# EasyEDA Pro project Echo EasyEDA professional project.epro, board PCB1
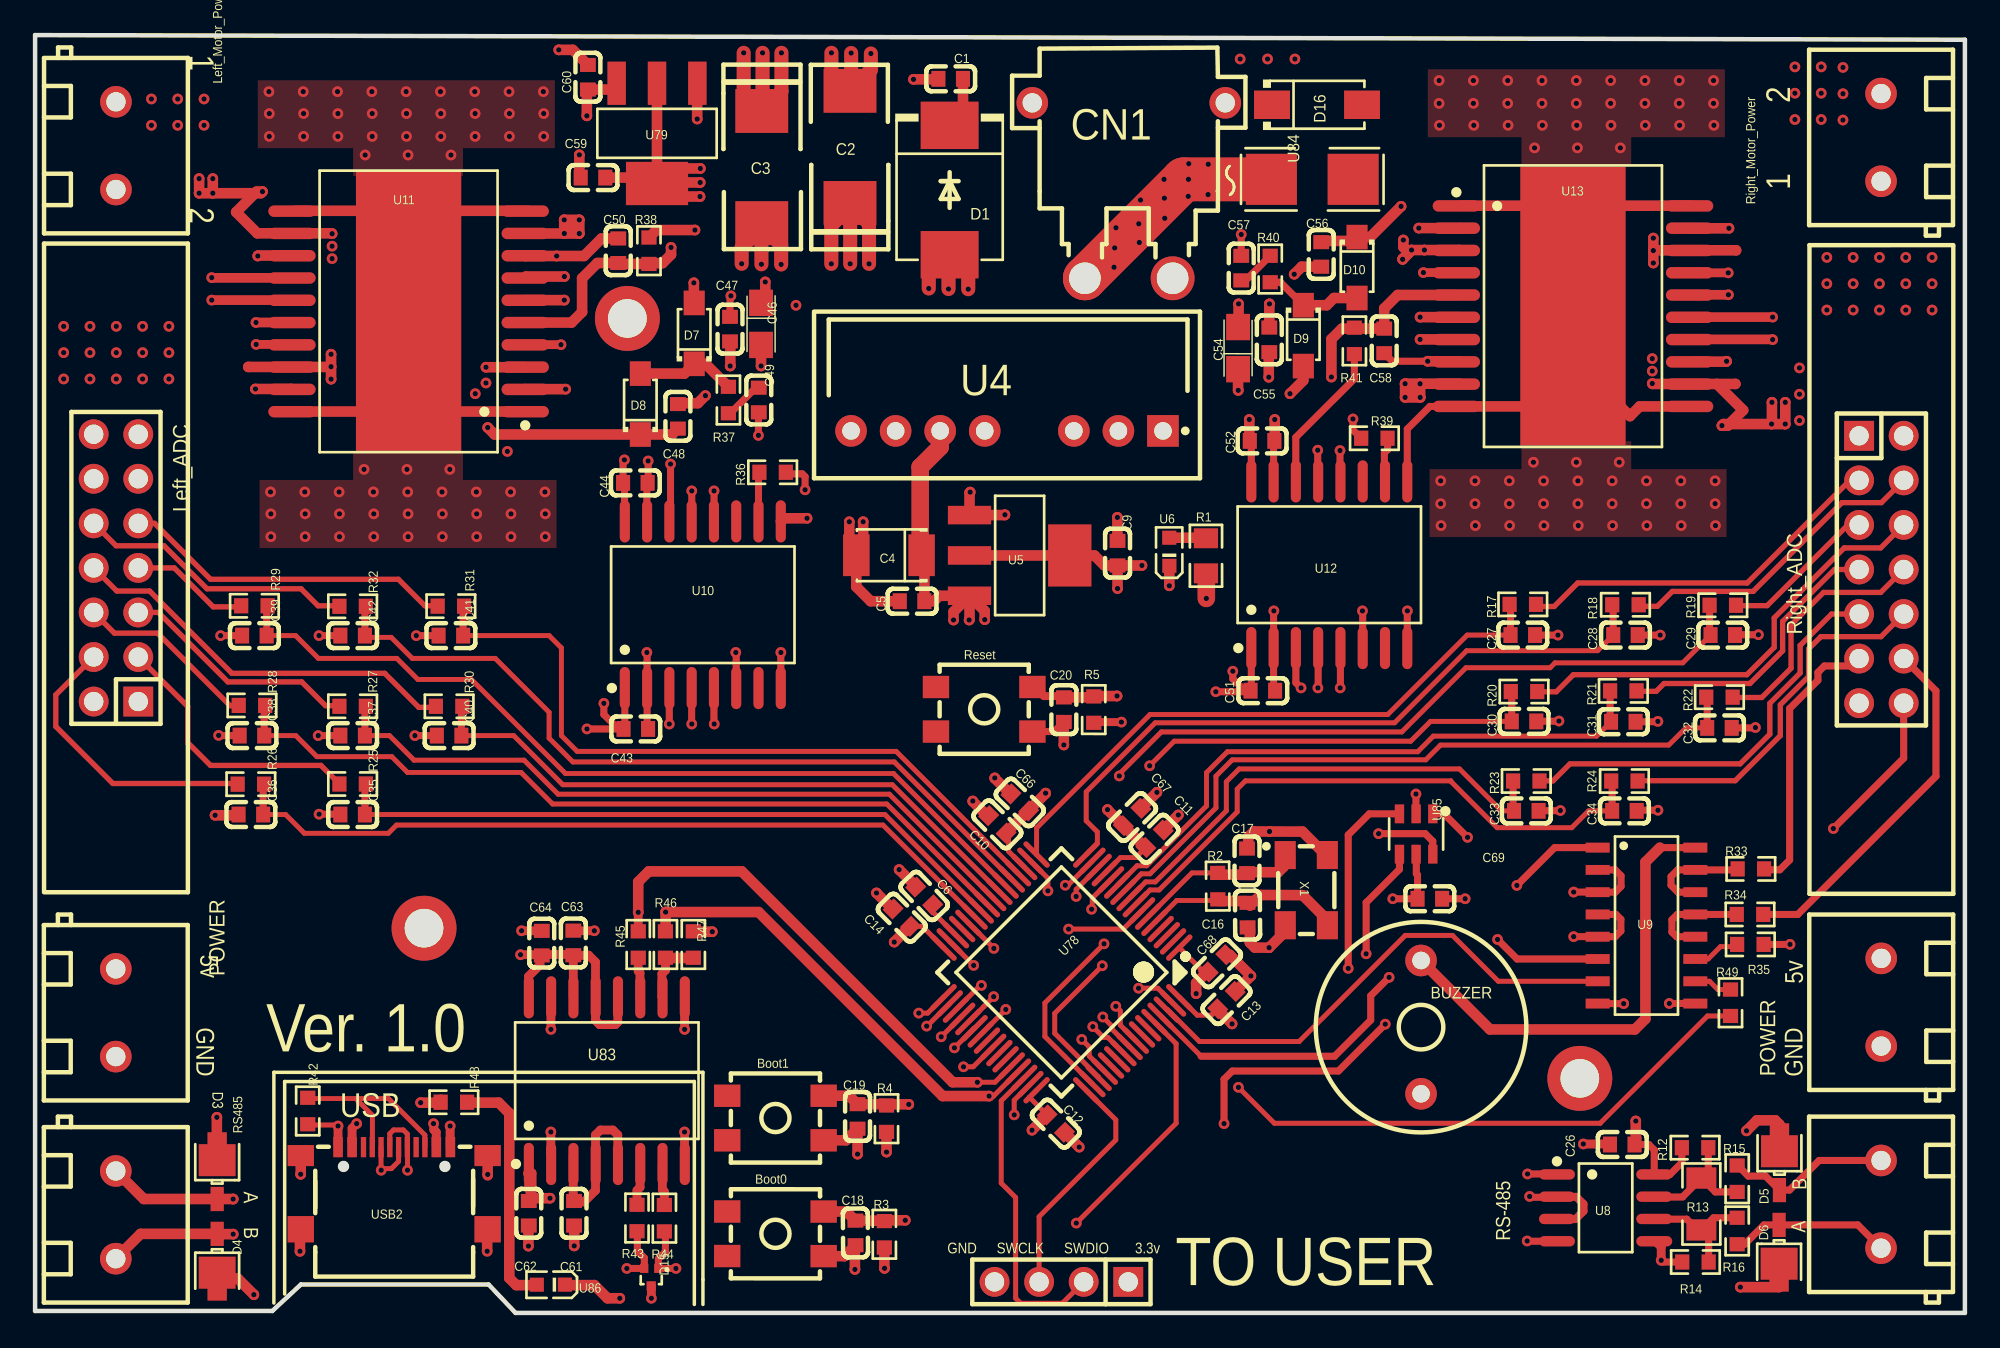
[diagram p1: board, top side]
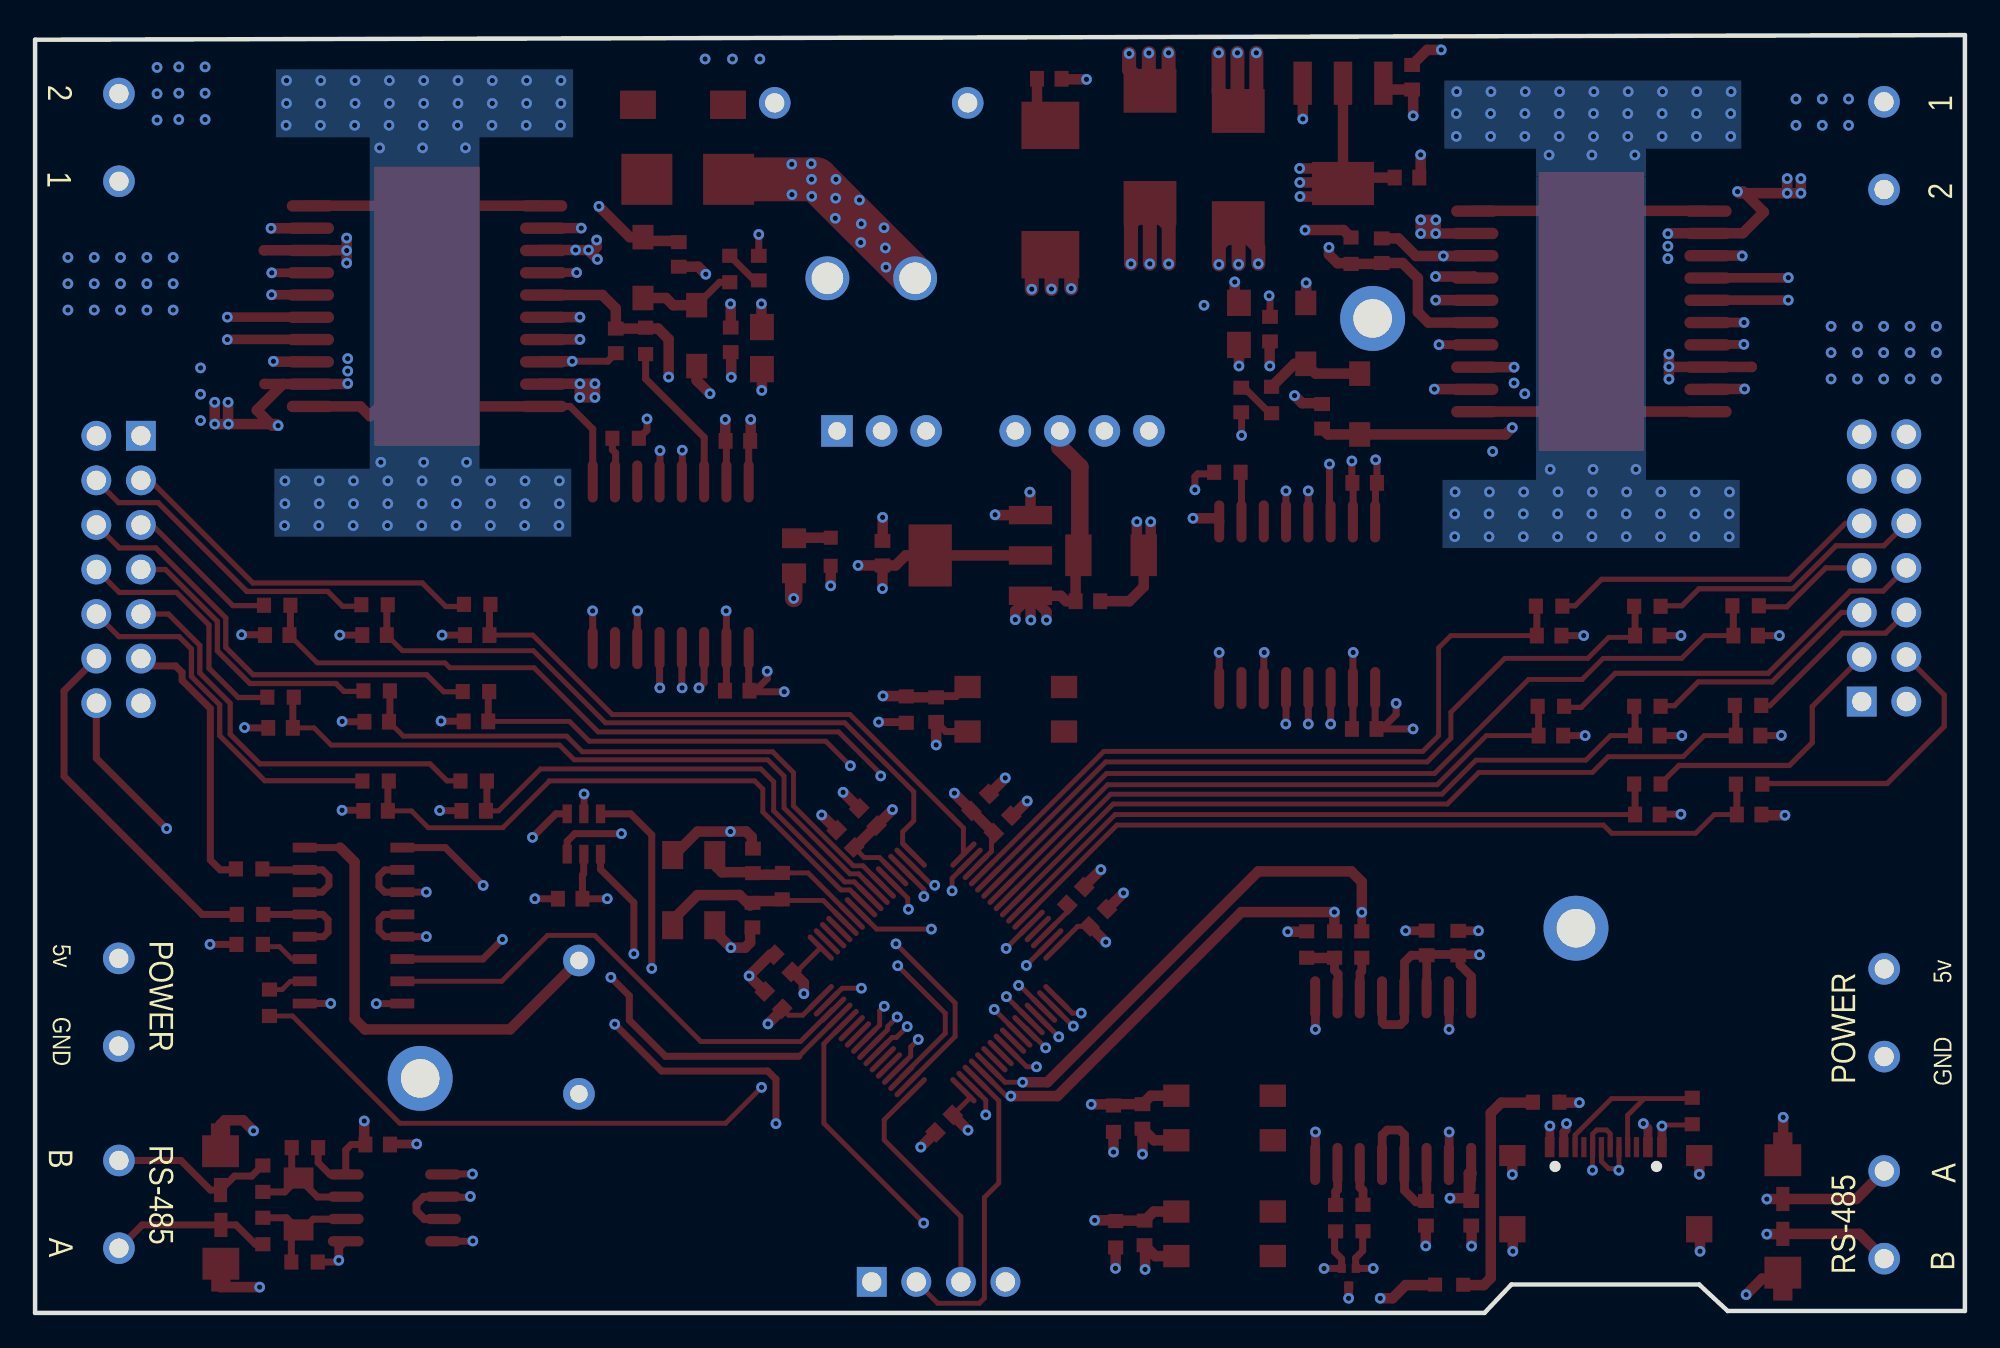
[diagram p2: board, bottom side, seen from below]

Outline 110 x 72.84 mm; copper layers: Top Layer, Inner1, Inner2, Bottom Layer. Coordinates in mm from the lower left corner of the outline.
Outline path: 0,72.84 0,0.11 13.52,0.11 15.15,1.62 25.85,1.62 27.39,0 110,0 110,72.58 0,72.84
Stack: Top Layer 0.035mm / Dielectric1 0.025mm FR4 er 4.5 / Dielectric4 0.48mm PP er 4.5 / Dielectric5 0.48mm PP er 4.5 / Inner1 0.035mm / Dielectric6 0.48mm PP er 4.5 / Inner2 0.035mm / Dielectric7 0.48mm PP er 4.5 / Bottom Layer 0.035mm

## Design rules (mm)
template: Custom Config
spacing copperThickness1oz (default): track to track 0.18, other pairs 0.18 to 0.3
spacing copperThickness2oz: track to track 0.203, other pairs 0.152 to 0.3
track width copperThickness1oz (default): min 0.127, default 0.254, max 2.54
track width copperThickness2oz: min 0.203, default 0.254, max 2.54
differential pair differentialPair (default): width min 0.127, default 0.254, max 2.54; gap min 0.152, default 0.152
via viaSize (default): diameter min 0.5, default 0.61, max 10; hole min 0.3, default 0.305, max 6.3

## Placement (name value [footprint] x y rotation side)
Boot0  7914G-1-000E  [KEY-SMD_4P-L5.0-W5.0-P2.54-LS5.5-BL]  42.2 4.51 180 top
Boot1  7914G-1-000E  [KEY-SMD_4P-L5.0-W5.0-P2.54-LS5.5-BL]  42.2 11.11 180 top
BUZZER  GMD12095YB-1.5V2400  [BUZ-TH_BD12.0-P7.60-D0.6-FD]  79 16.29 90 top
C1  0.1 uF 16v  [c0603]  52.19 70.35 180 top
C2  220 uF 16v  [CASE-E_7343]  46.45 66.47 270 top
C3  220 uF 16v  [CASE-E_7343]  41.42 65.32 90 top
C4  22 uF 10v  [CASE-B_3528]  48.67 43.19 180 top
C5  0.1 uF 10v  [C0603]  49.99 40.57 180 top
C6  4.7 uF 10v  [C0603]  50.68 23.77 313.6 top
C9  10 uF 10v  [C0603]  61.7 43.31 90 top
C10  0.1 uF 10v  [C0603]  54.85 27.85 315.1 top
C11  0.1 uF 10v  [C0603]  63.81 27.03 225 top
C12  0.1 uF 10v  [C0603]  58.18 10.79 135 top
C13  0.1 uF 10v  [C0603]  67.91 17.83 224.8 top
C14  0.1 uF 10v  [C0603]  49.4 22.53 315 top
C16  20 pF 10v  [C0603]  69.11 22.68 270.4 top
C17  20 pF 10v  [C0603]  69.08 25.77 89.9 top
C18  0.1 uF 10v  [C0603]  46.76 4.56 270.4 top
C19  0.1 uF 10v  [C0603]  46.88 11.2 270 top
C20  0.1 uF 10v  [C0603]  58.64 34.39 270 top
C26  0.1 uF 10v  [C0603]  90.47 9.6 0 top
C27  0.1 uF 10v  [C0603]  84.8 38.64 0 top
C28  0.1 uF 10v  [C0603]  90.65 38.64 0 top
C29  0.1 uF 10v  [C0603]  96.2 38.64 0 top
C30  0.1 uF 10v  [C0603]  84.87 33.72 0 top
C31  0.1 uF 10v  [C0603]  90.53 33.7 0 top
C32  0.1 uF 10v  [C0603]  96.01 33.35 180 top
C33  0.1 uF 10v  [C0603]  85 28.62 0 top
C34  0.1 uF 10v  [C0603]  90.59 28.62 0 top
C35  0.1 uF 10v  [C0603]  18.1 28.41 180 top
C36  0.1 uF 10v  [C0603]  12.3 28.41 180 top
C37  0.1 uF 10v  [C0603]  18.1 32.91 180 top
C38  0.1 uF 10v  [C0603]  12.36 32.91 180 top
C39  0.1 uF 10v  [C0603]  12.5 38.61 180 top
C40  0.1 uF 10v  [C0603]  23.6 32.91 0 top
C41  0.1 uF 10v  [C0603]  23.7 38.61 180 top
C42  0.1 uF 10v  [C0603]  18.1 38.61 0 top
C43  0.1 uF 10v  [C0603]  34.24 33.29 180 top
C44  0.1 uF 10v  [C0603]  34.21 47.32 180 top
C46  0,1 uF 16v  [CASE-A_3216]  41.38 56.38 270 top
C47  0,1 uF 16v  [C0603]  39.61 56.08 270 top
C48  CBoot_0,22uF 16v  [C0603]  36.64 51.11 90 top
C49  0,01 uF 16v  [C0603]  41.25 52.04 90 top
C50  5.6 nF 10v  [C0603]  33.24 60.55 90 top
C51  0.1 uF 10v  [C0603]  69.98 35.47 180 top
C52  0.1 uF 10v  [C0603]  69.94 49.71 180 top
C54  0,1 uF 16v  [CASE-A_3216]  68.57 55 90 top
C55  0,1 uF 16v  [C0603]  70.35 55.47 90 top
C56  CBoot_0,22uF 16v  [C0603]  73.31 60.34 270 top
C57  0,01 uF 16v  [C0603]  68.75 59.56 270 top
C58  5.6 nF 10v  [C0603]  76.9 55.41 270 top
C59  10 uF 16v  [C0603]  31.8 64.72 180 top
C60  0.1 uF 16v  [C0603]  31.51 70.44 90 top
C61  0.1uF 10v  [C0603]  30.72 5.68 270 top
C62  0.1uF 10v  [C0603]  28.14 5.68 270 top
C63  0.1uF 10v  [C0603]  30.68 21.09 90 top
C64  0.1uF 10v  [C0603]  28.88 21.08 270 top
C66  4.7 uF 10v  [C0603]  56.13 29.1 136.2 top
C67  1 uF 10v  [C0603]  62.53 28.27 224.8 top
C68  0.1 uF 10v  [C0603]  67.37 19.93 224.7 top
C69  0.1 uF 10v  [C0603]  79.5 23.61 180 top
CN1  XT30PW-M30.G.Y  [conn-th_xt30pw-m]  62.34 63.98 180 top
D1  SMCJ16A  [smc_l6.9-w5.9-ls7.9-rd]  52.13 64.01 270 top
D3  SM2T3V3A  [DO-216AA_L1.9-W1.9-LS3.8-FD]  10.38 7.77 270 top
D4  SM2T3V3A  [DO-216AA_L1.9-W1.9-LS3.8-FD]  10.38 3.23 90 top
D5  SM2T3V3A  [DO-216AA_L1.9-W1.9-LS3.8-FD]  99.43 8.28 270 top
D6  SM2T3V3A  [DO-216AA_L1.9-W1.9-LS3.8-FD]  99.41 3.74 90 top
D7  1N4148W  [SOD-123FL_L2.7-W1.6-LS3.8-RD]  37.57 55.84 90 top
D8  1N4148W  [SOD-123FL_L2.7-W1.6-LS3.8-RD]  34.5 51.81 90 top
D9  1N4148W  [SOD-123FL_L2.7-W1.6-LS3.8-RD]  72.29 55.71 270 top
D10  1N4148W  [SOD-123FL_L2.7-W1.6-LS3.8-RD]  75.35 59.59 270 top
D15  TPD2EUSB30DRTR-TP  [SOT-723-3_L1.2-W0.8-LS1.20-BR]  35.12 2.04 90 top
D16  SS510  [sma_l4.4-w2.8-ls5.4-rd]  73.07 68.87 0 top
H1  -  [HDR-TH_4P-P2.54-V-M]  58.5 1.77 180 top
Left_ADC  B-3100S14P-A110  [IDC-TH_310S-14P]  4.61 42.47 90 top
Left_Motor_Power  282836-2  [conn-th_2p-p5.00_282836-2]  4.61 66.54 270 top
NOREF  -  [Pad_e10924]  33.76 56.69 180 top
NOREF#2  -  [Pad_e12976]  22.17 21.93 180 top
NOREF#3  -  [Pad_e12977]  88.05 13.37 180 top
POWER  -  [conn-th_2p-p5.00_282836-2]  105.23 17.71 90 top
POWER#2  -  [conn-th_2p-p5.00_282836-2]  4.6 17.11 270 top
R1  150R  [R0805]  66.74 43.16 90 top
R2  1M  [R0603]  67.41 24.33 90.4 top
R3  10K  [R0603]  48.41 4.48 90 top
R4  10K  [R0603]  48.53 11.07 90 top
R5  10K  [R0603]  60.34 34.39 89.9 top
R12  20K  [R0603]  94.62 9.42 0 top
R13  120R  [R1206]  94.98 6.21 270 top
R14  20K  [R0603]  94.64 2.9 0 top
R15  47R  [R0603]  97.02 7.65 90 top
R16  47R  [R0603]  97.02 4.67 270 top
R17  10R  [R0603]  84.8 40.39 0 top
R18  10R  [R0603]  90.65 40.37 180 top
R19  10R  [R0603]  96.2 40.34 0 top
R20  10R  [R0603]  84.87 35.42 180 top
R21  10R  [R0603]  90.53 35.46 0 top
R22  10R  [R0603]  96.01 35.1 180 top
R23  10R  [R0603]  85 30.32 0 top
R24  10R  [R0603]  90.59 30.32 180 top
R25  10R  [R0603]  18.1 30.15 180 top
R26  10R  [R0603]  12.3 30.14 0 top
R27  10R  [R0603]  18.1 34.58 180 top
R28  10R  [R0603]  12.36 34.63 0 top
R29  10R  [R0603]  12.5 40.31 180 top
R30  10R  [R0603]  23.6 34.58 0 top
R31  10R  [R0603]  23.7 40.29 180 top
R32  10R  [R0603]  18.1 40.28 0 top
R33  150R  [R0603]  97.8 25.31 0 top
R34  150R  [R0603]  97.75 22.72 0 top
R35  150R  [R0603]  97.77 21.01 0 top
R36  10K  [R0603]  42.04 47.92 180 top
R37  100R  [R0603]  39.52 52.04 270 top
R38  10K  [R0603]  34.99 60.55 270 top
R39  10K  [R0603]  76.34 49.86 0 top
R40  100R  [R0603]  70.4 59.51 90 top
R41  10K  [R0603]  75.2 55.41 90 top
R42  5,1K  [R0603]  15.54 11.51 270 top
R43  24R  [R0603]  34.31 5.41 90 top
R44  24R  [R0603]  35.87 5.4 90 top
R45  24R  [R0603]  34.38 21 90 top
R46  24R  [R0603]  35.93 21 90 top
R47  330R  [R0603]  37.52 21 270 top
R48  1K  [R0603]  23.87 12.01 0 top
R49  150R  [R0603]  96.64 17.68 270 top
Reset  7914G-1-000E  [KEY-SMD_4P-L5.0-W5.0-P2.54-LS5.5-BL]  54.1 34.41 180 top
Right_ADC  B-3100S14P-A110  [IDC-TH_310S-14P]  105.24 42.38 270 top
Right_Motor_Power  282836-2  [conn-th_2p-p5.00_282836-2]  105.22 67.01 90 top
RS485  282836-2  [CONN-TH_2P-P5.00_282836-2]  4.6 5.59 270 top
RS485_2  282836-2  [CONN-TH_2P-P5.00_282836-2]  105.22 6.19 90 top
U4  UWF1205S-3WR3  [pwrm-th_uwfxxxxs-3wr3]  55.4 50.28 180 top
U5  LD1117S33TR  [SOT-223_L6.5-W3.5-P2.30-LS7.0-BR]  56.12 43.18 180 top
U6  KP-1608MGC  [LED0603-RD_GREEN]  64.65 43.39 90 top
U8  MAX485ESA  [SOIC-8_L4.9-W3.9-P1.27-LS6.0-BL]  89.52 5.99 270 top
U9  TBD62003AFG,EL  [SOP-16_L10.0-W4.4-P1.27-LS6.3-BL]  91.85 22.08 270 top
U10  ISO7740DWR  [SOIC-16_L10.3-W7.5-P1.27-LS10.3-BL]  38.06 40.37 0 top
U11  L6205PD  [POWERSO20_L15.9-W11.0-P1.27-LS14.2-BL-EP]  21.29 57.09 90 top
U12  ISO7740DWR  [SOIC-16_L10.3-W7.5-P1.27-LS10.3-BL]  73.77 42.65 0 top
U13  L6205PD  [POWERSO20_L15.9-W11.0-P1.27-LS14.2-BL-EP]  87.66 57.39 270 top
U78  STM32F401RET6  [LQFP-64_L10.0-W10.0-P0.50-LS12.0-BL]  58.5 19.41 135 top
U79  LD1117S33TR  [SOT-223_L6.5-W3.5-P2.30-LS7.0-BR]  35.45 67.24 90 top
U83  ADUM4160BRWZ-RL  [SOIC-16_L10.3-W7.5-P1.27-LS10.3-BL]  32.59 13.24 0 top
U84  045106.3MRL  [fuse-smd_l6.1-w2.6]  72.8 64.62 0 top
U85  MAX6817EUT+T  [SOT-23-6_L2.9-W1.6-P0.95-LS2.8-BL]  78.72 27.3 180 top
U86  KP-1608MGC  [LED0603-RD_GREEN]  29.4 1.61 180 top
USB2  USB-TYPE-C-020  [USB-SMD_USB-TYPE-C-020]  20.47 7.11 0 top
X1  16MHz  [CRYSTAL-SMD_4P-L5.0-W3.2-BL]  72.46 24.1 270 top

## Footprints (pads in the part's own frame, mm; a bottom-side part is the same pattern mirrored in y, then rotated)
BUZ-TH_BD12.0-P7.60-D0.6-FD
  round 1.8 hole 1: 1(-3.8,0) 2(3.8,0)
c0603
  rect 0.8x0.9 smd: 1(-0.7,0) 2(0.7,0)
C0603
  rect 0.8x0.9 smd: 1(-0.7,0) 2(0.7,0)
CASE-A_3216
  rect 1.5x1.359 smd: 1(-1.2,0) 2(1.2,0)
CASE-B_3528
  rect 1.506x2.376 smd: 1(-1.861,0) 2(1.861,0)
CASE-E_7343
  rect 2.5x3.01 smd: 1(3.196,0) 2(-3.196,0)
conn-th_2p-p5.00_282836-2
  round 1.8 hole 1.1: 1(-2.5,0) 2(2.5,0)
CONN-TH_2P-P5.00_282836-2
  round 1.8 hole 1.1: 1(-2.5,0) 2(2.5,0)
conn-th_xt30pw-m
  round 2.5 hole 1.8: 1(-2.5,5) 2(2.5,5)
  round 1.8 hole 1.1: 3(5.5,-5) 4(-5.5,-5)
CRYSTAL-SMD_4P-L5.0-W3.2-BL
  rect 1.6x1.2 smd: 1(-2,-1.2) 2(2,-1.2) 3(2,1.2) 4(-2,1.2)
DO-216AA_L1.9-W1.9-LS3.8-FD
  custom 2.5x2.1 smd: 1(-1.276,0)
  rect 1.38x0.75 smd: 2(1.276,0)
fuse-smd_l6.1-w2.6
  rect 2.91x2.91 smd: 1(-2.33,0) 2(2.33,0)
HDR-TH_4P-P2.54-V-M
  rect 1.7x1.7 hole 1.1: 1(-3.81,0)
  round 1.7 hole 1.1: 2(-1.27,0) 3(1.27,0) 4(3.81,0)
IDC-TH_310S-14P
  rect 1.7x1.7 hole 1.1: 1(-7.62,-1.27)
  round 1.7 hole 1.1: 2(-7.62,1.27) 3(-5.08,-1.27) 4(-5.08,1.27) 5(-2.54,-1.27) 6(-2.54,1.27) 7(0,-1.27) 8(0,1.27) 9(2.54,-1.27) 10(2.54,1.27) 11(5.08,-1.27) 12(5.08,1.27) 13(7.62,-1.27) 14(7.62,1.27)
KEY-SMD_4P-L5.0-W5.0-P2.54-LS5.5-BL
  rect 1.5x1.273 smd: 1(-2.75,-1.27) 2(2.75,-1.27) 3(2.75,1.27) 4(-2.75,1.27)
LED0603-RD_GREEN
  rect 0.8x0.8 smd: 1(-0.799,-0.004) 2(0.799,0.004)
LQFP-64_L10.0-W10.0-P0.50-LS12.0-BL
  oval 0.3x2 smd: 1(-3.75,-5.75) 2(-3.25,-5.75) 3(-2.75,-5.75) 4(-2.25,-5.75) 5(-1.75,-5.75) 6(-1.25,-5.75) 7(-0.75,-5.75) 8(-0.25,-5.75) 9(0.25,-5.75) 10(0.75,-5.75) 11(1.25,-5.75) 12(1.75,-5.75) 13(2.25,-5.75) 14(2.75,-5.75) 15(3.25,-5.75) 16(3.75,-5.75) 33(3.75,5.75) 34(3.25,5.75) 35(2.75,5.75) 36(2.25,5.75) 37(1.75,5.75) 38(1.25,5.75) 39(0.75,5.75) 40(0.25,5.75) 41(-0.25,5.75) 42(-0.75,5.75) 43(-1.25,5.75) 44(-1.75,5.75) 45(-2.25,5.75) 46(-2.75,5.75) 47(-3.25,5.75) 48(-3.75,5.75)
  oval 2x0.3 smd: 17(5.75,-3.75) 18(5.75,-3.25) 19(5.75,-2.75) 20(5.75,-2.25) 21(5.75,-1.75) 22(5.75,-1.25) 23(5.75,-0.75) 24(5.75,-0.25) 25(5.75,0.25) 26(5.75,0.75) 27(5.75,1.25) 28(5.75,1.75) 29(5.75,2.25) 30(5.75,2.75) 31(5.75,3.25) 32(5.75,3.75) 49(-5.75,3.75) 50(-5.75,3.25) 51(-5.75,2.75) 52(-5.75,2.25) 53(-5.75,1.75) 54(-5.75,1.25) 55(-5.75,0.75) 56(-5.75,0.25) 57(-5.75,-0.25) 58(-5.75,-0.75) 59(-5.75,-1.25) 60(-5.75,-1.75) 61(-5.75,-2.25) 62(-5.75,-2.75) 63(-5.75,-3.25) 64(-5.75,-3.75)
Pad_e10924
  round 3.7 hole 2.2: 65(0,0)
Pad_e12976
  round 3.7 hole 2.2: 65(0,0)
Pad_e12977
  round 3.7 hole 2.2: 65(0,0)
POWERSO20_L15.9-W11.0-P1.27-LS14.2-BL-EP
  oval 0.651x2.696 smd: 1(-5.715,-6.647) 2(-4.445,-6.647) 3(-3.175,-6.647) 4(-1.905,-6.647) 5(-0.635,-6.647) 6(0.635,-6.647) 7(1.905,-6.647) 8(3.175,-6.647) 9(4.445,-6.647) 10(5.715,-6.647) 11(5.715,6.647) 12(4.445,6.647) 13(3.175,6.647) 14(1.905,6.647) 15(0.635,6.647) 16(-0.635,6.647) 17(-1.905,6.647) 18(-3.175,6.647) 19(-4.445,6.647) 20(-5.715,6.647)
  rect 15.9x6 smd: 21(0,0)
pwrm-th_uwfxxxxs-3wr3
  rect 1.8x1.8 hole 1: 1(-8.89,0)
  round 1.8 hole 1: 2(-6.35,0) 3(-3.81,0) 5(1.27,0) 6(3.81,0) 7(6.35,0) 8(8.89,0)
R0603
  rect 0.806x0.864 smd: 1(-0.753,0) 2(0.753,0)
R0805
  rect 1.133x1.377 smd: 1(-1,0) 2(1,0)
R1206
  rect 1.208x1.701 smd: 1(-1.479,0) 2(1.479,0)
sma_l4.4-w2.8-ls5.4-rd
  rect 2.046x1.62 smd: 1(-2.566,0) 2(2.566,0)
smc_l6.9-w5.9-ls7.9-rd
  rect 2.7x3.3 smd: 1(-3.687,0) 2(3.687,0)
SOD-123FL_L2.7-W1.6-LS3.8-RD
  rect 1.4x1.2 smd: 1(-1.735,0) 2(1.735,0)
SOIC-8_L4.9-W3.9-P1.27-LS6.0-BL
  oval 0.588x2.045 smd: 1(-1.905,-2.772) 2(-0.635,-2.772) 3(0.635,-2.772) 4(1.905,-2.772) 5(1.905,2.772) 6(0.635,2.772) 7(-0.635,2.772) 8(-1.905,2.772)
SOIC-16_L10.3-W7.5-P1.27-LS10.3-BL
  oval 0.574x2.401 smd: 1(-4.445,-4.75) 2(-3.175,-4.75) 3(-1.905,-4.75) 4(-0.635,-4.75) 5(0.635,-4.75) 6(1.905,-4.75) 7(3.175,-4.75) 8(4.445,-4.75) 9(4.445,4.75) 10(3.175,4.75) 11(1.905,4.75) 12(0.635,4.75) 13(-0.635,4.75) 14(-1.905,4.75) 15(-3.175,4.75) 16(-4.445,4.75)
SOP-16_L10.0-W4.4-P1.27-LS6.3-BL
  rect 0.56x1.365 smd: 1(-4.445,-2.783) 2(-3.175,-2.783) 3(-1.905,-2.783) 4(-0.635,-2.783) 5(0.635,-2.783) 6(1.905,-2.783) 7(3.175,-2.783) 8(4.445,-2.783) 9(4.445,2.783) 10(3.175,2.783) 11(1.905,2.783) 12(0.635,2.783) 13(-0.635,2.783) 14(-1.905,2.783) 15(-3.175,2.783) 16(-4.445,2.783)
SOT-23-6_L2.9-W1.6-P0.95-LS2.8-BL
  rect 0.532x1.072 smd: 1(-0.95,-1.149) 2(0,-1.149) 3(0.95,-1.149) 4(0.95,1.149) 5(0,1.149) 6(-0.95,1.149)
SOT-223_L6.5-W3.5-P2.30-LS7.0-BR
  rect 2.465x1.05 smd: 1(2.857,-2.3) 2(2.857,0) 3(2.857,2.3)
  rect 2.465x3.54 smd: 4(-2.857,0)
SOT-723-3_L1.2-W0.8-LS1.20-BR
  rect 0.52x0.47 smd: 1(0.5,-0.4) 2(0.5,0.4)
  rect 0.52x0.52 smd: 3(-0.5,0)
USB-SMD_USB-TYPE-C-020
  rect 1.5x1.2 smd: 17(-5.325,1.86) 18(5.325,1.86)
  rect 1.5x1.5 smd: 19(-5.325,-2.34) 20(5.325,-2.34)
  rect 0.3x1.15 smd: A1(-3.325,2.34) A4(-2.525,2.34) A5(-1.25,2.34) A6(-0.25,2.34) A7(0.25,2.34) A8(1.25,2.34) A9(2.525,2.34) A12(3.325,2.34) B1(3.075,2.34) B4(2.275,2.34) B5(1.75,2.34) B6(0.75,2.34) B7(-0.75,2.34) B8(-1.75,2.34) B9(-2.275,2.34) B12(-3.075,2.34)

## Nets
3.3V: C44.2 C52.2 C59.1 R36.1 R39.1 U10.16 U12.16 U79.2 U79.4
5V: C4.1 C5.1 C26.2 POWER.2 POWER#2.1 R12.1 U4.6 U5.3 U8.8
5V_USB: C62.1 R48.1 U83.1 USB2.A4 USB2.A9 USB2.B4 USB2.B9
12V: C1.1 C2.1 C3.1 C46.1 C47.1 C48.2 C54.1 C55.1 C56.2 C60.1 CN1.3 CN1.4 D1.1 D7.2 D9.2 D16.1 U4.2 U11.2 U11.19 U13.2 U13.19 U79.3
AGND: C4.2 C5.2 C6.1 C9.2 C10.1 C11.1 C12.1 C13.1 C14.1 C16.2 C17.2 C20.2 C26.1 C27.2 C28.2 C29.2 C30.2 C31.2 C32.1 C33.2 C34.2 C35.2 C36.2 C37.2 C38.2 C39.2 C40.1 C41.2 C42.1 C43.1 C51.1 C63.2 C64.1 C66.2 C67.1 C68.1 C69.1 D3.1 D4.1 D5.1 D6.1 H1.4 Left_ADC.2 POWER.1 POWER#2.2 R3.1 R4.1 R14.1 Reset.4 Right_ADC.2 U4.7 U5.1 U6.1 U8.5 U9.8 U10.2 U10.6 U10.8 U12.2 U12.6 U12.8 U78.12 U78.18 U78.31 U78.47 U78.63 U83.9 U83.15 U85.2 X1.2 X1.4
GND: C1.2 C2.2 C3.2 C44.1 C46.2 C47.2 C50.2 C52.1 C54.2 C55.2 C58.2 C59.2 C60.2 CN1.1 D1.2 U4.1 U10.9 U10.15 U11.1 U11.8 U11.10 U11.11 U11.13 U11.20 U11.21 U12.9 U12.15 U13.1 U13.8 U13.10 U13.11 U13.13 U13.20 U13.21 U79.1
+3.3AV: Boot0.4 Boot1.4 BUZZER.1 C9.1 C10.2 C11.2 C12.2 C13.2 C14.2 C18.2 C19.2 C43.2 C51.2 C63.1 C64.2 C66.1 C67.2 C68.2 C69.2 H1.1 Left_ADC.1 R1.1 R5.1 R47.1 Right_ADC.1 U5.2 U5.4 U9.9 U10.1 U12.1 U78.1 U78.13 U78.19 U78.32 U78.48 U78.64 U83.12 U83.13 U83.14 U83.16 U85.5
ADC1_IN0: C30.1 R20.2 U78.14
ADC1_IN1: C29.1 R19.1 U78.15
ADC1_IN2: C28.1 R18.2 U78.16
ADC1_IN3: C27.1 R17.1 U78.17
ADC1_IN4: C41.1 R31.1 U78.20
ADC1_IN5: C42.2 R32.2 U78.21
ADC1_IN6: C39.1 R29.1 U78.22
ADC1_IN7: C40.2 R30.2 U78.23
ADC1_IN8: C35.1 R25.1 U78.26
ADC1_IN9: C36.1 R26.2 U78.27
ADC1_IN10: C34.1 R24.2 U78.8
ADC1_IN11: C33.1 R23.1 U78.9
ADC1_IN12: C32.2 R22.2 U78.10
ADC1_IN13: C31.1 R21.1 U78.11
ADC1_IN14: C37.1 R27.1 U78.24
ADC1_IN15: C38.1 R28.2 U78.25
BOOT0: Boot0.1 C18.1 R3.2 U78.60
BOOT1: Boot1.1 C19.1 R4.2 U78.28
BUZZER: U9.1 U78.41
DIRECTION_LEFT_MOTOR: U10.5 U78.57
DIRECTION_LEFT_MOTOR_ISO: U10.12 U11.7 U11.15
DIRECTION_RIGHT_MOTOR: U12.5 U78.52
DIRECTION_RIGHT_MOTOR_ISO: U12.12 U13.7 U13.15
ENABLE_1: C50.1 R38.2 U11.5 U11.16
ENABLE_2: C58.1 R41.2 U13.5 U13.16
ENABLE_LEFT_MOTOR: U10.3 U78.55
ENABLE_LEFT_MOTOR_ISO: R38.1 U10.14
ENABLE_RIGHT_MOTOR: U12.3 U78.51
ENABLE_RIGHT_MOTOR_ISO: R41.1 U12.14
NRST: C20.1 R5.2 Reset.1 U78.7
OUT1_1: Left_Motor_Power.1 U11.9 U11.12
OUT1_2: Right_Motor_Power.1 U13.9 U13.12
OUT2_1: Left_Motor_Power.2 U11.3 U11.18
OUT2_2: Right_Motor_Power.2 U13.3 U13.18
PH0/OSC/IN: C16.1 R2.1 U78.5 X1.3
PH1/OSC/OUT: C17.1 R2.2 U78.6 X1.1
RE_DE: U8.2 U8.3 U78.39
SENSE_LVL_1: U9.2 U9.3 U78.33
SENSE_LVL_1_OUT: R33.2 Right_ADC.11
SENSE_LVL_2: U9.4 U9.5 U78.34
SENSE_LVL_2_OUT: R34.2 Right_ADC.12
SENSE_LVL_3: U9.6 U78.35
SENSE_LVL_3_OUT: R35.2 Right_ADC.13
SENSE_SIGNAL: Right_ADC.14 U85.1
SENSE_SIGNAL_CLEAR: U78.36 U85.6
START_DATASET_COLLECTION: Left_ADC.14 U85.3
START_DATASET_COLLECTION_CLEAR: U78.61 U85.4
START_DATASET_COLLECTION_LED: U9.7 U78.62
START_DATASET_COLLECTION_OUT: Left_ADC.11 R49.2
SWCLK: H1.3 U78.49
SWDIO: H1.2 U78.46
TIM2_CH1_PWM_RIGHT: U12.4 U78.50
TIM2_CH1_PWM_RIGHT_ISO: U12.13 U13.6 U13.14
TIM3_CH1_PWM_LEFT: U10.4 U78.56
TIM3_CH1_PWM_LEFT_ISO: U10.13 U11.6 U11.14
UGND: C61.2 C62.2 D15.3 R42.2 U83.2 U83.8 U86.1 USB2.17 USB2.18 USB2.19 USB2.20 USB2.A1 USB2.A12 USB2.B1 USB2.B12
USART6_RX: U8.1 U78.38
USART6_TX: U8.4 U78.37
USB_DM: R45.2 U78.44
USB_DP: R46.2 U78.45
VBOOT_1: C48.1 D8.1 U11.17
VBOOT_2: C56.1 D10.1 U13.17
VCAP_1: C6.2 U78.30
VCP_1: C49.1 U11.4
VCP_2: C57.1 U13.4
$1N14481: R1.2 U6.2
$1N50612: R34.1 U9.12 U9.13
$1N52994: C49.2 R37.2
$1N52996: D7.1 D8.2 R37.1
$1N54500: C57.2 R40.2
$1N54502: D9.1 D10.2 R40.1
$1N66553: CN1.2 U84.1
$1N88741: R39.2 U12.10
$1N90501: R36.2 U10.10
$1N102361: R13.2 R14.2 R16.1 U8.6
$1N102367: R12.2 R13.1 R15.1 U8.7
$1N106732: Left_ADC.4 R26.1
$1N106734: Left_ADC.6 R28.1
$1N106736: Left_ADC.8 R30.1
$1N110429: Left_ADC.10 R32.1
$1N122577: R18.1 Right_ADC.4
$1N122580: R20.1 Right_ADC.6
$1N122586: R22.1 Right_ADC.8
$1N122589: R17.2 Right_ADC.3
$1N122592: R19.2 Right_ADC.5
$1N122595: R21.2 Right_ADC.7
$1N122604: R24.1 Right_ADC.10
$1N122607: R23.2 Right_ADC.9
$1N145821: R43.2 U83.6
$1N145822: R44.2 U83.7
$1N145824: R45.1 U83.11
$1N145826: R46.1 R47.2 U83.10
$1N145828: C61.1 U83.3 U83.4 U83.5
$1N145834: R42.1 USB2.A5 USB2.B5
$1N145837: D15.2 R43.1 USB2.A7 USB2.B7
$1N145838: D15.1 R44.1 USB2.A6 USB2.B6
$1N154907: Left_ADC.3 R25.2
$1N154909: Left_ADC.5 R27.2
$1N154911: Left_ADC.7 R29.2
$1N154913: Left_ADC.9 R31.2
$1N155259: R33.1 U9.14 U9.15
$1N155266: BUZZER.2 U9.16
$1N162172: D4.2 D6.2 R16.2 RS485.2 RS485_2.1
$1N162185: D3.2 D5.2 R15.2 RS485.1 RS485_2.2
$1N162956: D16.2 U84.2
$1N163037: R35.1 U9.11
$1N163078: R49.1 U9.10
$1N182203: R48.2 U86.2

Pads without a net: Boot0 2 3; Boot1 2 3; Left_ADC 12 13; NOREF 65; NOREF#2 65; NOREF#3 65; Reset 2 3; U4 3 5 8; U10 7 11; U12 7 11; U78 2 3 4 29 40 42 43 53 54 58 59; USB2 A8 B8

## Via types
v1: diameter 0.61, hole 0.305, Top Layer to Bottom Layer, 457 vias

## Routing (per net, layer and track width the routed paths; a pad name or vN(x,y) marks a point on that pad's centre or on a via; arc(x,y) is an arc through that point)
3.3V: length 27.2
  Top Layer w0.4: v1(75.12,50.96) 75.12,50.33 R39.1 ; 33.6,45.14 33.6,47.23 ; C52.2 69.32,49.63 69.32,47.4 ; v1(43.89,46.92) 43.89,47.67 43.73,47.83 42.77,47.83 ; v1(33.59,48.63) 33.51,48.55 C44.2
  Top Layer w0.6: U79.4 36.19,63.64 v1(37.9,63.64) ; U79.4 35.2,64.13 34.61,64.72 C59.1 ; U79.4 U79.2 ; U79.4 35.51,64.44 ; v1(37.91,64.44) 35.51,64.44 ; 35.51,64.44 36.31,65.24 v1(37.92,65.24) ; C52.2 69.21,49.74 v1(69.21,50.93)
5V: length 160.7
  Top Layer w0.4: R12.1 93.87,8.57 93.19,7.9 U8.8 92.29,9.29 91.98,9.6 C26.2
  Top Layer w0.6: v1(53.24,39.5) 53.26,39.52 U5.3 ; C26.2 91.24,9.67 v1(91.24,10.94) ; v1(52.35,39.5) 52.35,39.97 U5.3 ; U5.3 54.13,40.01 v1(54.13,39.52) ; U5.3 51.54,40.88 51.23,40.57 C5.1 50.69,43.03 C4.1
  Top Layer w1: C4.1 50.45,43.27 50.45,48.22 51.59,49.36 U4.6
  Inner2 w2: 95.93,15.16 96.1,15.33 96.1,29.5 93.67,31.93 83.58,31.93 77.44,38.07 55.58,38.07 v1(54.13,39.52) 54.11,39.5 v1(53.24,39.5) v1(52.35,39.5) 33.74,39.5 20.31,26.07 11.06,26.07 POWER#2.1 ; 95.93,15.16 100.18,15.16 POWER.2 ; 95.93,15.16 91.71,10.94 v1(91.24,10.94)
5V_USB: length 8.9
  Top Layer w0.5: 18.33,10.79 18.07,10.53 18.07,9.61 ; 22.73,10.74 22.73,10.44 22.87,10.3 22.87,9.57 22.88,9.56 ; 28.13,7.04 28.13,9.43 ; 28.28,6.54 28.13,6.62
  Top Layer w0.6: 23.12,12.16 22.95,11.99 v1(21.98,11.99) ; v1(29.35,6.54) 28.28,6.54 28.28,6.55 28.28,7.96 28.13,7.96
  vias: v1(18.33,10.79) v1(22.71,10.79)
12V: length 48.2
  Top Layer w0.4: v1(39.66,57.98) 39.61,57.93 C47.1
  Top Layer w0.6: C54.1 68.57,52.6 v1(68.58,52.59) ; v1(71.77,59.21) 72.2,59.64 C56.2 ; v1(12.56,52.67) 14.6,52.67 14.61,52.66 ; D9.2 72.29,53.16 v1(71.53,52.4) ; 41.47,68.56 C3.1 ; v1(78.87,61.84) 81.2,61.84 81.2,61.85 ; C55.1 70.32,54.74 v1(70.32,53.34) ; 36.67,51.86 37.78,51.86 v1(38.21,52.29) ; 94.5,61.85 94.51,61.83 v1(96.55,61.83) ; D1.1 52.14,67.71 52.89,68.46 C1.1 ; U79.3 32.79,69.74 C60.1 31.45,69.68 v1(31.45,68.24) ; 41.41,57.7 41.62,57.91 v1(41.62,58.77) ; 37.47,57.53 37.55,57.6 v1(37.55,58.72) ; 46.46,63.07 46.51,63.12 ; v1(30.24,52.66) 27.91,52.66 27.91,52.66
  Top Layer w0.8: v1(45.38,59.8) 45.38,62 46.46,63.07 v1(46.46,59.8) ; 46.51,63.12 47.54,62.09 v1(47.54,59.8) ; v1(41.47,71.83) 41.47,68.56 42.54,69.64 v1(42.54,71.83) ; v1(40.39,71.83) 40.39,69.55 C3.1
  Top Layer w2: 52.14,67.71 52.13,67.71
  vias: v1(56.89,68.96) v1(68.69,71.48) v1(70.25,71.48) v1(71.81,71.48)
AGND: length 114.9
  Top Layer w0.28: v1(60.22,23.01) 60.26,23.05 60.26,23.64 U78.12 ; v1(62.9,18.51) 64,18.51 U78.63 ; v1(55.81,11.29) 55.81,12.12 U78.47 ; U78.18 57.73,24.78 v1(57.73,24.06) ; v1(53.5,19.81) 52.14,21.17 U78.31
  Top Layer w0.4: C32.1 98.04,33.35 v1(98.06,33.37) ; v1(34.87,37.65) 34.89,37.64 U10.2 34.89,33.35 C43.1 ; C27.2 v1(86.8,38.64) ; v1(92.5,33.72) 92.48,33.7 C31.2 ; U12.8 78.22,40.02 v1(78.22,40.02) ; U9.8 89.07,17.63 v1(90.55,17.63) ; v1(10.58,38.61) C39.2 ; v1(42.51,37.65) 42.5,37.65 U10.8 ; v1(21.73,38.61) C41.2 ; v1(39.94,37.65) 39.97,37.63 U10.6 ; v1(98.23,38.66) 96.92,38.66 C29.2 ; v1(86.94,28.64) 86.93,28.63 85.7,28.63 ; Reset.4 58.09,33.14 58.64,33.69 ; v1(16.18,38.61) C42.1 ; 21.65,32.91 C40.1 ; v1(75.66,40.02) 75.68,40.01 U12.6 ; v1(78.71,29.58) 78.71,28.46 U85.2 ; C38.2 10.47,32.91 v1(10.46,32.92) ; 70.58,39.99 70.59,39.98 U12.2 70.59,35.56 C51.1 ; v1(16.14,32.91) C37.2 ; v1(16.19,28.43) 17.41,28.43 ; v1(86.86,33.74) 86.85,33.73 85.57,33.73 ; v1(92.69,3) 92.79,2.9 R14.1 ; v1(81.51,23.61) C69.1 ; C28.2 v1(92.63,38.64) ; v1(92.5,28.66) 91.29,28.66
  Top Layer w0.5: 28.88,21.84 28.83,21.79 v1(27.73,21.79) ; v1(29.4,16.16) 29.4,18.02 ; v1(31.88,21.79) 30.68,21.79 ; v1(88.25,9.63) 89.72,9.63 89.73,9.62 ; v1(37.02,16.16) 37.02,18.02 ; 92.37,4.08 92.69,3.76 v1(92.69,3)
  Top Layer w0.6: v1(47.96,23.94) 48.88,23.03 48.91,23.03 ; 50.2,24.28 50.2,24.32 v1(49.25,25.27) ; 73.56,26.11 72.24,27.44 v1(70.36,27.44) 69.47,27.45 69.15,27.13 69.15,26.43 ; C5.2 47.63,40.57 46.81,41.39 46.81,43.19 ; v1(47.2,45.1) 47.2,43.58 46.81,43.19 ; 46.41,45.08 46.41,43.59 46.81,43.19 ; v1(97.2,1.47) 99.41,1.47 D6.1 ; 69.24,21.83 69.24,21.11 69.53,20.82 v1(70.34,20.82) 71.14,21.62 71.14,22.12 ; R3.1 48.41,2.55 v1(48.42,2.54) ; 54.3,28.3 53.45,29.16 v1(53.45,29.18) ; v1(64.65,41.45) 64.65,42.59 64.65,42.59 ; v1(10.26,28.37) 11.56,28.37 C36.2 ; C9.2 61.69,44.02 v1(61.69,45.35) ; v1(12.47,1.04) 11.56,1.96 10.38,1.96 ; R4.1 v1(48.53,9.17) ; v1(97.55,10.38) 98.15,10.98 99.19,10.98 99.43,10.74 D5.1 ; v1(59.51,9.45) C12.1 ; v1(10.36,11.15) 10.36,9.21 10.38,9.18 ; v1(53.3,46.79) 53.26,46.75 U5.1 55.26,45.48 v1(55.28,45.5) ; C68.1 68.09,20.42 v1(69.3,19.21) 68.41,18.32 C13.1 ; 64.31,27.53 65.16,28.38 ; v1(58.64,32.38) 58.64,33.69 ; 63.08,28.82 63.94,29.68 ; 55.56,29.62 54.7,30.48 v1(54.7,30.5)
  vias: v1(21.65,32.91) v1(46.41,45.1) v1(63.94,29.68) v1(65.17,28.38) v1(70.61,40.02)
GND: length 242
  Top Layer w0.4: 34.87,45.14 34.87,47.27 ; C58.2 77.36,54.25 v1(79.38,54.25) ; U12.9 78.22,50.39 79.5,51.68 U13.10 ; v1(34.94,48.57) 34.94,47.35 ; C52.1 70.59,49.67 U12.15
  Top Layer w0.6: 19.76,52.6 19.76,52.12 19.03,51.39 14.61,51.39 ; U79.1 37.74,70.09 v1(37.74,68.06) ; 94.5,54.23 96.39,54.23 v1(96.42,54.25) ; v1(70.66,50.93) 70.66,49.73 C52.1 ; 20.79,60.59 20.79,60.39 21.79,59.39 ; 20.79,60.59 18.7,62.68 18.7,62.83 ; 20.79,60.59 20.79,60.79 ; 86.16,52.89 84.94,51.68 U13.10 ; v1(70.36,57.52) 70.35,57.51 C55.2 ; C50.2 32.29,61.25 31.29,60.25 v1(29.73,60.25) 27.93,60.25 27.91,60.28 ; 81.2,63.12 86.13,63.12 86.35,62.9 86.35,61.9 ; 21.46,57.59 21.79,57.92 21.79,59.25 ; 39.63,55.33 39.63,53.99 v1(39.62,53.98) ; U13.11 91.46,51.68 90.91,51.12 87.66,54.37 U13.21 ; 14.61,60.28 12.72,60.28 v1(12.69,60.25) ; 22.95,61.61 24.17,62.83 28.1,62.83 ; 31.02,64.72 v1(31.02,66.02) ; 27.91,51.39 22.97,51.39 22.76,51.6 22.76,52.6 ; 41.4,61.87 41.46,61.93 ; 81.2,54.23 81.18,54.25 v1(79.38,54.25) ; 18.69,62.83 14.8,62.83 ; 89.35,61.9 89.35,62.38 90.09,63.12 94.5,63.12 ; 20.79,60.79 20.99,60.59 ; 20.79,60.79 20.79,61.59 ; 21.45,57.11 21.45,57.25 21.79,57.59 ; v1(44,45.3) 42.68,45.3 U10.9 ; 46.51,69.73 C2.2 ; C1.2 51.46,70.32 v1(50.07,70.32) ; C60.2 30.65,72 v1(29.85,72) ; v1(41.38,53.98) 41.38,54.78 ; 21.47,59.59 21.46,59.58 ; v1(68.6,57.52) 68.6,56.72
  Top Layer w0.8: 41.46,61.93 42.53,60.87 v1(42.53,59.77) ; 52.13,60.52 53.19,59.46 v1(53.19,58.36) ; v1(47.64,71.79) 47.64,70.86 46.51,69.73 v1(46.51,71.82) ; v1(40.28,59.81) 40.28,60.74 41.4,61.87 v1(41.4,59.78) ; v1(45.39,71.83) 45.39,70.73 C2.2 ; v1(52.06,58.37) 52.06,60.46 50.94,59.33 v1(50.94,58.4)
  Inner1 w0.6: CN1.1 61.81,55.95 44.86,55.95 v1(43.37,57.44) ; v1(29.73,60.25) 32.39,60.25
  Inner1 w0.675: v1(96.42,54.25) 97.17,53.5 97.17,50.35 96.23,49.41 79.32,49.41 76.17,52.56 76.17,53.76 76.66,54.25 78.26,54.25 ; v1(12.69,60.25) 11.94,61 11.94,64.15 12.88,65.09 29.79,65.09 33.51,61.37 32.39,60.25
  Inner1 w0.75: v1(79.38,54.25) 78.26,54.25
  Inner2 w0.6: v1(79.38,54.25) 74.97,54.25 70.41,58.81 68.61,58.81 66.91,57.11 66.71,57.11 CN1.1 ; v1(29.73,60.25) 34.66,60.25 39.22,55.69 40.5,55.69 42.25,57.44 v1(43.37,57.44)
  vias: v1(13.33,69.62) v1(13.35,68.37) v1(13.35,67.07) v1(13.42,46.8) v1(13.44,45.55) v1(13.44,44.25) v1(15.28,69.62) v1(15.3,68.37) v1(15.3,67.07) v1(15.37,46.8) v1(15.39,45.55) v1(15.39,44.25) v1(17.24,69.62) v1(17.26,68.37) v1(17.26,67.07) v1(17.33,46.8) v1(17.35,45.55) v1(17.35,44.25) v1(18.81,66.01) v1(18.75,48.09) v1(19.19,69.62) v1(19.22,68.37) v1(19.22,67.07) v1(19.28,46.8) v1(19.31,45.55) v1(19.31,44.25) v1(21.15,69.62) v1(21.17,68.37) v1(21.17,67.07) v1(21.2,48.09) v1(21.24,46.8) v1(21.26,66.01) v1(21.26,45.55) v1(21.26,44.25) v1(23.1,69.62) v1(23.13,68.37) v1(23.13,67.07) v1(23.19,46.8) v1(23.22,45.55) v1(23.22,44.25) v1(23.64,48.09) v1(23.7,66.01) v1(25.06,69.62) v1(25.08,68.37) v1(25.08,67.07) v1(25.15,46.8) v1(25.17,45.55) v1(25.17,44.25) v1(27.02,69.62) v1(27.04,68.37) v1(27.04,67.07) v1(27.1,46.8) v1(27.13,45.55) v1(27.13,44.25) v1(28.97,69.62) v1(28.99,68.37) v1(28.99,67.07) v1(29.06,46.8) v1(29.08,45.55) v1(29.08,44.25) v1(80.03,70.25) v1(80.03,68.95) v1(80.05,67.7) v1(80.12,47.43) v1(80.12,46.13) v1(80.14,44.88) v1(81.98,70.25) v1(81.98,68.95) v1(82.01,67.7) v1(82.07,47.43) v1(82.07,46.13) v1(82.09,44.88) v1(83.94,70.25) v1(83.94,68.95) v1(83.96,67.7) v1(84.03,47.43) v1(84.03,46.13) v1(84.05,44.88) v1(85.41,48.49) v1(85.47,66.41) v1(85.89,70.25) v1(85.89,68.95) v1(85.92,67.7) v1(85.98,47.43) v1(85.98,46.13) v1(86.01,44.88) v1(87.85,70.25) v1(87.85,68.95) v1(87.87,67.7) v1(87.91,66.41) v1(87.85,48.49) v1(87.94,47.43) v1(87.94,46.13) v1(87.96,44.88) v1(89.81,70.25) v1(89.81,68.95) v1(89.83,67.7) v1(89.89,47.43) v1(89.89,46.13) v1(89.92,44.88) v1(90.3,48.49) v1(90.36,66.41) v1(91.76,70.25) v1(91.76,68.95) v1(91.78,67.7) v1(91.85,47.43) v1(91.85,46.13) v1(91.87,44.88) v1(93.72,70.25) v1(93.72,68.95) v1(93.74,67.7) v1(93.81,47.43) v1(93.81,46.13) v1(93.83,44.88) v1(95.67,70.25) v1(95.67,68.95) v1(95.69,67.7) v1(95.76,47.43) v1(95.76,46.13) v1(95.78,44.88)
+3.3AV: length 82.8
  Top Layer w0.28: U78.64 66.24,16.97 67.05,16.97 C13.2 ; 55.3,27.32 55.49,27.12 55.49,26.31 56.38,25.42 ; 49.9,22.04 50.57,22.04 U78.32 ; C68.2 66.74,19.3 U78.1 ; U78.48 56.68,12.29 57.69,11.29 ; 60.97,25.07 61.87,25.96 62.74,25.96 63.31,26.54
  Top Layer w0.4: C51.2 69.32,35.52 69.32,37.9 ; C51.2 68.95,35.47 68.27,36.15 v1(68.27,36.58) ; C51.2 69.22,35.41 v1(67.3,35.41) ; U10.1 33.61,33.37 C43.2 ; C43.2 33.24,33.29 32.42,34.11 v1(32.42,34.75) ; C43.2 v1(31.46,33.29) ; v1(77.39,23.61) C69.2 78.8,24.97 78.73,25.04 78.73,26.14 U85.5 ; U9.9 94.63,17.64 v1(93.15,17.64)
  Top Layer w0.45: v1(61.92,33.68) 60.33,33.68 60.3,33.66
  Top Layer w0.5: 28.78,20.34 28.88,20.44 30.63,20.44 30.68,20.39 ; 28.78,20.34 28.78,19.84 28.13,19.19 28.13,18.02 28.13,18.02 ; 28.78,20.34 28.69,20.42 v1(27.67,20.42) ; 30.68,20.39 31.54,20.39 31.55,20.4 31.94,20 31.94,16.67 32.18,16.44 33.08,16.44 33.21,16.57 33.21,18.02 ; 30.68,20.39 30.68,18.02 30.67,18.02
  Top Layer w0.6: 63.31,26.54 63.27,26.54 C67.2 61.13,28.68 v1(61.13,28.69) ; v1(63.09,42.61) C9.1 ; C9.1 60.95,42.61 60.38,43.18 U5.4 U5.2 ; C9.1 v1(61.7,41.29) ; C68.2 66.81,19.44 66.18,18.81 v1(66.18,18.2) ; Boot1.4 46.22,9.84 C19.2 v1(46.88,9.05) ; 46.73,3.82 46.14,3.24 Boot0.4 ; 46.73,3.82 v1(46.73,2.48) ; 46.73,3.82 C18.2 ; C10.2 57.6,29.61 v1(57.6,29.63) ; 57.69,11.29 57.69,11.28 v1(56.82,10.42) ; 49.9,22.04 49.87,22.04 v1(48.97,21.14) ; v1(68.23,16.48) 67.41,17.29 C13.2 ; v1(38.6,21.73) 37.54,21.73 37.53,21.74
  Top Layer w1: v1(66.76,40.73) 66.76,42.14 R1.1
ADC1_IN0: length 34.8
  Top Layer w0.28: C30.1 79.54,33.72 78.41,32.59 64.93,32.59 v1(63.53,31.19) ; 60.62,25.42 59.34,24.14 v1(59.34,23.74)
  Top Layer w0.4: R20.2 84.17,35.37 C30.1
  Inner2 w0.28: v1(63.53,31.19) 62.11,29.77 62.11,26.51 v1(59.34,23.74)
ADC1_IN1: length 48.4
  Top Layer w0.28: U78.15 58.87,24.38 v1(58.72,24.38) ; v1(61.8,30.61) 61.8,30.72 64.2,33.12 77.9,33.12 81.56,36.78 86.36,36.78 86.64,37.06 93.92,37.06 C29.1
  Top Layer w0.4: C29.1 95.45,38.69 R19.1
  Inner2 w0.28: v1(61.8,30.61) 58.72,27.53 v1(58.72,24.38)
ADC1_IN2: length 39.6
  Top Layer w0.28: C28.1 89.06,37.75 81.6,37.75 77.49,33.64 63.85,33.64 59.91,29.7 59.91,28.06 60.55,27.42 60.55,26.76 U78.16
  Top Layer w0.4: R18.2 89.95,40.32 C28.1
ADC1_IN3: length 34.9
  Top Layer w0.28: U78.17 57.09,27.65 63.55,34.11 77.1,34.11 81.63,38.64 C27.1
  Top Layer w0.4: C27.1 84.1,40.34 84.05,40.39
ADC1_IN4: length 41.9
  Top Layer w0.28: C41.1 29.3,38.61 30,37.91 30,32.91 30.9,32.01 49.08,32.01 U78.20
  Top Layer w0.4: R31.1 24.4,40.24 C41.1
ADC1_IN5: length 45.2
  Top Layer w0.28: C42.2 18.9,38.51 20.3,38.51 21.5,37.31 26.23,37.31 29.3,34.24 29.3,32.76 30.65,31.41 48.97,31.41 U78.21
  Top Layer w0.4: R32.2 18.8,40.23 C42.2
ADC1_IN6: length 49.7
  Top Layer w0.28: U78.22 48.93,30.75 30.23,30.75 24.87,36.11 21.82,36.11 20.62,37.31 16.15,37.31 14.85,38.61 C39.1
  Top Layer w0.4: C39.1 13.2,40.26 R29.1
ADC1_IN7: length 36
  Top Layer w0.28: U78.23 48.86,30.11 30.08,30.11 27.28,32.91 C40.2
  Top Layer w0.4: R30.2 24.3,34.53 C40.2
ADC1_IN8: length 39.1
  Top Layer w0.28: U78.26 48.44,28.41 C35.1
  Top Layer w0.4: C35.1 18.8,30.1 R25.1
ADC1_IN9: length 45.1
  Top Layer w0.28: C36.1 14.28,28.41 15.35,27.34 20.13,27.34 20.6,27.81 48.33,27.81 U78.27
  Top Layer w0.4: C36.1 13,30.09 R26.2
ADC1_IN10: length 34.1
  Top Layer w0.28: 62.74,23.3 63.55,24.11 64.07,24.11 68.52,28.56 68.52,29.86 68.99,30.33 80.7,30.33 80.7,30.3 83.34,27.66 87.59,27.66 88.55,28.62 C34.1
  Top Layer w0.4: R24.2 89.89,30.27 C34.1
ADC1_IN11: length 28.7
  Top Layer w0.28: 62.39,23.65 63.31,24.57 63.85,24.57 67.91,28.63 67.9,28.64 67.9,30.28 68.63,31.01 81.19,31.01 83.58,28.62 C33.1
  Top Layer w0.4: R23.1 84.25,28.67 C33.1
ADC1_IN12: length 40
  Top Layer w0.28: C32.2 94.1,33.35 93.12,32.37 80.11,32.37 79.27,31.53 68.24,31.53 67.31,30.6 67.31,28.79 63.55,25.03 63.06,25.03 U78.10
  Top Layer w0.4: C32.2 95.31,35.05 R22.2
ADC1_IN13: length 34.9
  Top Layer w0.28: C31.1 89.01,32.88 79.7,32.88 78.81,31.99 67.96,31.99 66.77,30.8 66.77,28.9 63.36,25.49 62.81,25.49 U78.11
  Top Layer w0.4: R21.1 89.78,33.75 C31.1
ADC1_IN14: length 41.3
  Top Layer w0.28: 54.61,23.65 48.69,29.57 29.81,29.57 27.87,31.51 21.6,31.51 20.2,32.91 C37.1
  Top Layer w0.4: C37.1 18.8,34.53 R27.1
ADC1_IN15: length 46.9
  Top Layer w0.28: C38.1 14.86,32.91 16.06,31.71 20.33,31.71 21.23,30.81 27.7,30.81 29.5,29.01 48.55,29.01 54.26,23.3
  Top Layer w0.4: C38.1 13.06,34.58 R28.2
BOOT0: length 29
  Top Layer w0.28: v1(59.35,5.12) 65.04,10.81 65.04,15.35 U78.60
  Top Layer w0.6: v1(49.6,5.28) 48.45,5.28 48.41,5.24 48.38,5.26 C18.1 46.24,5.78 Boot0.1
  Inner2 w0.6: v1(49.6,5.28) 49.76,5.12 v1(59.35,5.12)
BOOT1: length 22.7
  Top Layer w0.28: v1(54.65,20.78) 54.65,20.79 U78.28
  Top Layer w0.6: Boot1.1 46.4,12.38 C19.1 48.46,11.9 R4.2 48.6,11.89 v1(49.8,11.89)
  Inner2 w0.6: v1(54.65,20.78) 50.43,20.78 47.14,17.49 47.14,14.55 v1(49.8,11.89)
BUZZER: length 46.9
  Top Layer w0.28: 54.61,15.17 53.47,14.03 v1(52.92,14.03)
  Top Layer w0.4: 89.07,26.53 86.62,26.53 v1(84.46,24.37)
  Inner1 w0.6: v1(52.92,14.03) 53.21,14.32 80.17,14.32 84.46,18.61 v1(84.46,24.37)
DIRECTION_LEFT_MOTOR: length 34.4
  Top Layer w0.28: 62.74,15.52 61.86,16.4 61.86,17.22 v1(61.6,17.48)
  Top Layer w0.4: v1(38.71,33.57) 38.69,33.59 U10.5
  Inner2 w0.4: v1(38.71,33.57) 38.71,33 43.15,28.56 50.1,28.56 61.18,17.48 v1(61.6,17.48)
DIRECTION_LEFT_MOTOR_ISO: length 58.7
  Top Layer w0.4: v1(38.7,46.86) 38.7,45.13 U10.12
  Top Layer w0.55: 14.61,57.74 v1(10.07,57.74)
  Top Layer w0.6: v1(30.17,59.08) 27.98,59.08 27.91,59.01
  Inner1 w0.8: v1(30.17,59.08) 29.11,59.08 27.55,57.52 27.55,49.76 26.9,49.11 12.89,49.11 10.79,51.21 10.79,57.01 v1(10.07,57.74)
  Inner2 w0.6: v1(26.92,49.11) 30.04,49.11 34.25,44.9 36.74,44.9 v1(38.7,46.86)
DIRECTION_RIGHT_MOTOR: length 33.5
  Top Layer w0.28: v1(59.66,15.59) 60.09,15.16 60.09,14.64 60.97,13.75
  Top Layer w0.4: U12.5 74.41,35.72 74.39,35.7
  Inner2 w0.6: v1(59.66,15.59) 59.96,15.29 61.76,15.29 75.74,29.27 75.74,34.28 v1(74.39,35.63)
DIRECTION_RIGHT_MOTOR_ISO: length 62
  Top Layer w0.4: U12.12 74.38,47.43 v1(74.38,49.16)
  Top Layer w0.55: 94.5,56.77 v1(99.04,56.77)
  Top Layer w0.6: v1(78.94,55.5) 81.2,55.5
  Inner1 w0.4: v1(78.94,55.5) 74.84,55.5 73.04,53.69 73.04,52.93 74.38,51.59 v1(74.38,49.16)
  Inner1 w0.8: v1(99.04,56.77) 98.32,57.49 98.32,63.99 97.35,64.96 78.49,64.96 76.87,63.34 76.87,59.26 77.71,58.42 78.84,58.42 80.92,56.34 80.08,55.5 v1(78.94,55.5)
ENABLE_1: length 59.6
  Top Layer w0.55: 14.61,56.47 14.61,56.46 v1(12.59,56.46)
  Top Layer w0.6: v1(36.25,60.74) 36.25,60.33 35.76,59.84 35.1,59.84 ; U11.5 30.58,56.46 31.18,57.06 31.18,58.98 32.05,59.85 C50.1 33.29,59.8 R38.2
  Inner1 w0.55: v1(12.59,56.46) 11.09,57.96 11.09,69.64 12.52,71.07 29.99,71.07 32.32,68.74 32.32,65.08 36.25,61.15 v1(36.25,60.74)
ENABLE_2: length 58.5
  Top Layer w0.55: 94.5,58.04 94.5,58.04 v1(96.52,58.04)
  Top Layer w0.6: U13.5 77.66,58.03 76.9,57.26 C58.1 75.25,56.11 R41.2 75.15,56.11 74.49,56.11 73.89,55.51 v1(73.89,53.35)
  Inner1 w0.55: v1(73.89,53.35) 78.04,49.2 78.04,44.51 79.24,43.31 96.47,43.31 98.02,44.86 98.02,56.54 v1(96.52,58.04)
ENABLE_LEFT_MOTOR: length 35.7
  Top Layer w0.28: v1(60.29,16.32) 60.91,15.71 61.14,15.71 U78.55
  Top Layer w0.4: 36.15,33.56 36.15,35.61 U10.3
  Inner2 w0.4: v1(60.29,16.32) 49.23,27.38 42.34,27.38 v1(36.15,33.57)
ENABLE_LEFT_MOTOR_ISO: length 20
  Top Layer w0.4: U10.14 36.22,45.19 v1(36.22,48.39)
  Top Layer w0.6: R38.1 35.42,61.73 v1(37.61,61.73)
  Inner1 w0.6: v1(36.22,48.39) 36.22,58.8 37.61,60.19 v1(37.61,61.73)
ENABLE_RIGHT_MOTOR: length 32.1
  Top Layer w0.28: v1(60.83,19.79) 58.12,17.08 58.12,15.94 60.62,13.44 60.62,13.4
  Top Layer w0.4: U12.3 71.87,35.93 v1(72.16,35.63)
  Inner2 w0.6: v1(60.83,19.79) 60.12,20.5 60.12,21.34 72.16,33.38 v1(72.16,35.63)
ENABLE_RIGHT_MOTOR_ISO: length 8.6
  Top Layer w0.4: U12.14 71.86,47.41 71.86,49.91 75.2,53.25 R41.1
NRST: length 29
  Top Layer w0.28: U78.7 62.03,21.88 v1(58.91,21.88)
  Top Layer w0.45: 58.69,35.16 57.51,35.16 56.94,35.73
  Top Layer w0.6: C20.1 60.29,35.09 60.34,35.15 ; 56.94,35.73 56.94,35.73 ; v1(61.67,35.17) 61.66,35.17 60.3,35.17
  Inner2 w0.4: v1(61.67,35.17) 62.45,35.17 63.2,34.42 63.2,33.7 55.75,26.25 55.75,24.22 58.09,21.88 v1(58.91,21.88)
OUT1_1: length 76.7
  Top Layer w0.6: 27.91,61.55 27.92,61.53 v1(30.17,61.53) ; v1(9.35,64.66) v1(9.35,63.83) v1(10.13,63.83) ; v1(30.17,61.53) 30.16,61.54 v1(30.16,62.31) ; v1(30.17,61.53) 30.17,61.53 30.94,61.53 ; v1(30.16,62.31) 30.94,61.53 ; v1(30.16,62.31) v1(31.02,62.31) 31.02,61.53 ; 30.94,61.53 v1(31.02,61.53) ; 12.54,63.83 12.87,63.83 v1(12.96,63.92) 12.63,63.92 12.54,63.83 ; 12.54,63.83 v1(10.13,63.83) ; 12.54,63.83 11.46,62.75 12.67,61.55 16.91,61.55 v1(16.93,61.52) ; v1(10.13,63.83) v1(10.13,64.66)
  Inner1 w0.6: 9.72,64.25 9.35,64.61 ; 9.72,64.25 9.35,63.88 ; 9.72,64.25 v1(10.13,63.83) v1(10.13,64.66) 9.72,64.25 ; 9.35,64.61 v1(9.35,64.66) ; 9.35,64.61 9.35,63.88 ; v1(12.96,63.92) 29.55,63.92 30.16,63.31 v1(30.16,62.31) ; 9.35,63.88 v1(9.35,63.83) ; v1(16.93,61.52) 18.16,62.75 24.31,62.75 25.53,61.53 25.53,61.52 30.15,61.52 v1(30.17,61.53)
  Inner1 w1: v1(30.16,62.31) v1(31.02,62.31) 31.02,61.53 ; v1(31.02,61.53) 30.17,61.53 v1(30.17,61.53) ; v1(16.93,60.1) v1(16.93,60.81) v1(16.93,61.52)
  Inner2 w1: v1(31.02,61.53) 30.17,61.53 v1(30.17,61.53) ; v1(30.16,62.31) 28.88,63.59 19,63.59 v1(16.93,61.52) ; 31.02,61.53 v1(31.02,62.31)
  vias: v1(6.63,69.2) v1(6.63,67.7) v1(8.13,69.2) v1(8.13,67.7) v1(9.63,69.2) v1(9.63,67.7)
OUT1_2: length 74.1
  Top Layer w0.6: v1(99,51.91) 99,50.69 v1(98.98,50.67) ; v1(78.95,52.19) v1(78.09,52.19) 78.09,52.97 ; v1(78.95,52.19) 78.17,52.97 ; v1(78.95,52.19) 78.95,52.96 v1(78.94,52.97) ; 95.87,52.96 92.21,52.96 v1(92.18,52.98) ; 95.87,52.96 96.91,52.96 96.92,52.96 ; 95.87,52.96 97.36,51.46 96.57,50.67 ; 78.17,52.97 78.94,52.97 v1(78.94,52.97) ; 78.17,52.97 v1(78.09,52.97) ; v1(98.98,50.67) 96.57,50.67 ; v1(98.98,50.67) v1(99.76,50.67) v1(99.76,51.91) ; 96.57,50.67 96.48,50.58 v1(96.15,50.58) 96.24,50.67 96.57,50.67 ; v1(78.94,52.97) 81.19,52.97 81.2,52.96
  Inner1 w0.6: v1(96.15,50.58) 79.56,50.58 78.95,51.19 v1(78.95,52.19) ; v1(92.18,52.98) 90.95,51.75 84.8,51.75 83.58,52.97 83.58,52.98 78.96,52.98 v1(78.94,52.97)
  Inner1 w1: v1(78.09,52.97) 78.94,52.97 v1(78.94,52.97) ; v1(92.18,52.98) v1(92.18,53.69) v1(92.18,54.4) ; 78.09,52.97 v1(78.09,52.19) v1(78.95,52.19)
  Inner2 w1: v1(78.94,52.97) 78.94,52.97 v1(78.09,52.97) ; 78.09,52.97 v1(78.09,52.19) ; v1(92.18,52.98) 90.11,50.91 80.23,50.91 v1(78.95,52.19)
  vias: v1(100.57,53.87) v1(100.57,52.37) v1(100.57,50.87) v1(102.13,60.17) v1(102.13,58.67) v1(102.13,57.17) v1(103.63,60.17) v1(103.63,58.67) v1(103.63,57.17) v1(105.13,60.17) v1(105.13,58.67) v1(105.13,57.17) v1(106.63,60.17) v1(106.63,58.67) v1(106.63,57.17) v1(108.13,60.17) v1(108.13,58.67) v1(108.13,57.17)
OUT2_1: length 34.6
  Top Layer w0.6: 12.15,53.93 12.16,53.93 16.85,53.93 v1(16.87,53.94) ; v1(16.87,53.94) v1(16.87,54.65) ; v1(16.87,53.94) v1(16.87,53.23) ; v1(25.7,53.91) 27.93,53.91 U11.3
  Inner1 w1: v1(16.87,54.65) v1(16.87,53.94) v1(16.87,53.23) 16.87,52.21 17.65,51.43 24.12,51.43 v1(25.09,52.4) v1(25.7,53.01) v1(25.7,53.91)
  Inner2 w1: v1(25.7,53.91) 25.7,53.07 24.06,51.43 17.7,51.43 16.87,52.26 v1(16.87,53.23) v1(16.87,53.94) v1(16.87,54.65)
  vias: v1(1.63,56.24) v1(1.63,54.74) v1(1.63,53.24) v1(3.13,56.24) v1(3.13,54.74) v1(3.13,53.24) v1(4.63,56.24) v1(4.63,54.74) v1(4.63,53.24) v1(6.13,56.24) v1(6.13,54.74) v1(6.13,53.24) v1(7.63,56.24) v1(7.63,54.74) v1(7.63,53.24)
OUT2_2: length 48.5
  Top Layer w0.6: 78.31,60.44 78.31,60.42 v1(77.95,60.06) 77.95,60.08 78.31,60.44 ; 78.31,60.44 v1(78.46,60.59) v1(79.19,60.59) 81.19,60.59 81.2,60.58 ; 78.31,60.44 77.99,60.76 v1(77.99,61.16) ; 96.96,60.57 96.96,60.58 92.26,60.58 v1(92.24,60.56) ; v1(92.24,61.27) v1(92.24,60.56) ; v1(92.24,60.56) v1(92.24,59.85)
  Inner1 w1: v1(77.99,61.16) 77.99,60.17 77.95,60.17 ; v1(92.24,59.85) v1(92.24,60.56) v1(92.24,61.27) 90.44,63.07 84.99,63.07 82.51,60.59 v1(79.19,60.59) v1(78.46,60.59)
  Inner2 w1: v1(77.99,61.16) 78.46,60.69 v1(78.46,60.59) 78.46,60.57 v1(77.95,60.06) ; v1(79.19,60.59) 82.57,63.97 91.22,63.97 92.24,62.95 v1(92.24,61.27) v1(92.24,60.56) v1(92.24,59.85)
  vias: v1(100.31,71.03) v1(100.31,69.53) v1(100.31,68.03) v1(101.81,71.03) v1(101.81,69.53) v1(101.81,68.03) v1(103.05,71) v1(103.05,69.5) v1(103.05,68)
PH0/OSC/IN: length 11.6
  Top Layer w0.28: R2.1 67.35,23.51 65.07,23.51 U78.5
  Top Layer w0.6: 67.45,23.48 69,23.47 69.25,23.23 69.85,23.82 72.25,23.82 73.55,22.51 73.54,22.11
PH1/OSC/OUT: length 9.6
  Top Layer w0.28: 67.41,25.08 65.94,25.08 U78.6
  Top Layer w0.6: 71.16,26.12 71.16,25.42 70.85,25.12 69.25,25.13 69.11,24.98 67.45,24.99
RE_DE: length 45.8
  Top Layer w0.28: v1(55.33,17.3) U78.39
  Top Layer w0.4: v1(85.19,6.64) 85.24,6.59 87.2,6.59
  Top Layer w0.45: 86.83,6.62 87.85,6.62 88.26,6.21 88.26,5.8 87.81,5.35 86.83,5.35
  Inner2 w0.4: v1(85.19,6.64) 85.19,6.92 86.12,7.85 86.12,9.58 80.97,14.73 63.47,14.73 62.48,13.74 58.89,13.74 v1(55.33,17.3)
SENSE_LVL_1: length 48.5
  Top Layer w0.28: U78.33 50.88,17.09 v1(50.37,17.09)
  Top Layer w0.4: v1(87.7,23.99) 89.06,23.99 U9.3 90.07,23.99 90.4,24.31 90.4,24.92 90.06,25.26 U9.2
  Inner1 w0.4: v1(87.7,23.99) 86.34,25.35 57.77,25.35 50.37,17.95 v1(50.37,17.09)
SENSE_LVL_1_OUT: length 15.8
  Top Layer w0.4: 98.46,25.26 99.45,25.26 100.01,25.82 100.01,34.45 101.62,36.06 101.62,36.51 101.99,36.88 103.55,36.88 Right_ADC.11
SENSE_LVL_2: length 56.7
  Top Layer w0.28: U78.34 50.84,16.35 v1(50.82,16.35)
  Top Layer w0.4: U9.4 90.11,22.72 90.39,22.44 90.39,21.77 90.06,21.45 U9.5 89.06,21.45 v1(87.7,21.45)
  Inner1 w0.4: v1(50.82,16.35) 50.42,15.95 49.83,15.95 49.24,16.54 49.24,17.75 57.66,26.17 86.7,26.17 88.51,24.36 88.51,22.26 v1(87.7,21.45)
SENSE_LVL_2_OUT: length 20.6
  Top Layer w0.4: Right_ADC.12 108.35,35.46 108.35,30.59 100.47,22.72 R34.2
SENSE_LVL_3: length 43.3
  Top Layer w0.28: 52.49,17.29 53.87,18.67 v1(53.94,18.67)
  Top Layer w0.4: v1(83.36,21.29) 84.47,20.18 U9.6
  Inner1 w0.4: v1(53.94,18.67) 56.35,21.08 58.3,21.08 60.63,18.75 61.49,18.75 64.72,15.52 77.59,15.52 v1(83.36,21.29)
SENSE_LVL_3_OUT: length 16.9
  Top Layer w0.4: R35.2 100.02,21.01 v1(100.03,21.01)
  Inner2 w0.4: v1(100.03,21.01) 103.97,24.95 Right_ADC.13
SENSE_SIGNAL: length 32.6
  Top Layer w0.4: Right_ADC.14 106.51,31.62 v1(102.5,27.61) ; v1(81.65,27.11) 80.31,28.45 U85.1
  Inner1 w0.4: v1(102.5,27.61) 101.79,26.9 81.86,26.9 v1(81.65,27.11)
SENSE_SIGNAL_CLEAR: length 44.2
  Top Layer w0.28: v1(51.65,15.74) 52.84,16.94
  Top Layer w0.4: U85.6 79.67,26.89 79.24,27.32 v1(76.58,27.32)
  Inner1 w0.4: v1(76.58,27.32) 76.27,27.01 72.4,27.01 71.2,28.21 69.6,28.21 68.4,27.01 57.43,27.01 48.5,18.08 48.5,16.31 49.6,15.21 51,15.21 51.53,15.74 v1(51.65,15.74)
START_DATASET_COLLECTION: length 133.8
  Top Layer w0.4: U85.3 76.05,28.45 74.85,27.25 v1(74.85,19.64) ; v1(67.77,10.79) 67.77,13.32 68.24,13.79 74.29,13.79 v1(76.96,16.46)
  Inner2 w0.28: v1(67.77,10.79) 65.75,8.77 49.81,8.77 39.25,19.33 8.39,19.33 6.12,17.06 3.15,17.06 0.9,19.31 0.9,47.65 Left_ADC.14
  Inner2 w0.4: v1(76.96,16.46) 74.85,18.57 v1(74.85,19.64)
START_DATASET_COLLECTION_CLEAR: length 25
  Top Layer w0.28: 64.16,16.94 66.46,14.63
  Top Layer w0.4: 66.46,14.63 74.07,14.63 76.13,16.69 76.13,18.08 v1(77.18,19.13) ; U85.4 77.77,25.29 75.87,23.39 v1(75.87,20.47)
  Inner2 w0.4: v1(75.87,20.47) 77.18,19.16 v1(77.18,19.13)
START_DATASET_COLLECTION_LED: length 28.9
  Top Layer w0.28: 64.51,17.29 64.55,17.29 66.37,15.47 72.05,15.47 78.1,21.52 80.79,21.52 83.4,18.91 U9.7
START_DATASET_COLLECTION_OUT: length 140.4
  Top Layer w0.28: v1(68.59,12.86) 70.64,10.81 89.21,10.81 95.33,16.93 R49.2
  Inner2 w0.28: v1(68.59,12.86) 67.79,12.06 59.56,12.06 57.15,9.65 50.85,9.65 40.07,20.43 30.65,20.43 26.51,24.57 21.06,24.57 19.57,23.08 11.16,23.08 5.85,17.77 3.67,17.77 1.72,19.72 1.72,45.87 2.08,46.23 4.56,46.23 Left_ADC.11
SWCLK: length 13.4
  Top Layer w0.28: U78.49 61.6,11.01 61.6,9.86 57.23,5.49 H1.3
SWDIO: length 17.9
  Top Layer w0.28: 56.38,13.4 55.07,12.09 55.07,7.4 55.89,6.58 55.89,0.84 56.18,0.55 58.55,0.55 H1.2
TIM2_CH1_PWM_RIGHT: length 38.5
  Top Layer w0.28: v1(60.93,21.04) 57.56,17.67 57.56,15.75 U78.50
  Top Layer w0.4: 73.12,35.67 73.13,35.69 U12.4
  Inner2 w0.6: v1(60.93,21.04) 62.67,19.3 64.66,19.3 74.93,29.57 74.93,33.82 v1(73.12,35.63)
TIM2_CH1_PWM_RIGHT_ISO: length 75.2
  Top Layer w0.4: v1(73.11,49.18) 73.11,47.43 U12.13
  Top Layer w0.55: 94.5,55.5 99.03,55.5 v1(99.04,55.48)
  Top Layer w0.6: v1(78.94,56.77) 81.2,56.77
  Inner1 w0.4: 77.92,56.77 75.93,56.77 ; v1(73.11,49.18) 73.11,51.95 72.26,52.8 72.26,53.85 75.18,56.77
  Inner1 w0.6: 75.93,56.77 75.18,56.77
  Inner1 w0.8: v1(99.04,55.48) 100.17,55.48 100.45,55.76 100.45,56.9 99.4,57.95 99.4,64.72 97.16,66.96 97.16,70.81 96.33,71.64 78.74,71.64 78.74,66.7 75.81,63.77 75.81,58.88 77.92,56.77 v1(78.94,56.77)
TIM3_CH1_PWM_LEFT: length 34.9
  Top Layer w0.28: 62.39,15.17 61.4,16.16 61.4,16.33 v1(60.86,16.87)
  Top Layer w0.4: U10.4 37.42,33.58 v1(37.43,33.57)
  Inner2 w0.4: v1(37.43,33.57) 37.43,33.28 42.75,27.96 49.77,27.96 v1(60.86,16.87)
TIM3_CH1_PWM_LEFT_ISO: length 69.7
  Top Layer w0.4: U10.13 37.43,45.13 v1(37.43,46.86)
  Top Layer w0.55: 14.61,59.01 10.08,59.01 v1(10.07,59.02)
  Top Layer w0.6: v1(30.17,57.74) 27.91,57.74
  Inner1 w0.6: v1(37.43,46.86) 33.43,42.86 31.17,42.86
  Inner1 w0.8: v1(10.07,59.02) 8.94,59.02 8.66,58.74 8.66,57.6 9.71,56.55 9.71,49.78 11.43,48.06 11.95,48.06 11.95,43.69 12.78,42.86 31.17,42.86 31.13,42.91 31.13,56.94 30.33,57.74 v1(30.17,57.74)
UGND: length 17.4
  Top Layer w0.28: 15.55,10.71 17.21,10.71 v1(17.27,10.66)
  Top Layer w0.5: v1(37.02,10.32) 37.02,9.02 37.02,9.01 ; 29.4,9.01 29.4,9.02 v1(29.4,10.32) ; 23.66,10.62 23.66,9.54 ; v1(35.13,0.84) 35.13,1.54 ; 17.27,9.55 v1(17.27,10.66)
  Top Layer w0.6: 15.14,4.74 15.1,4.7 v1(15.1,3.51) ; v1(33.33,0.84) 32.63,0.84 31.88,1.59 30.53,1.59 ; 28.13,5.06 28.12,5.05 v1(28.12,3.81) ; 15.14,8.95 15.14,7.91 v1(15.14,7.91) ; 25.77,3.59 25.77,4.72 25.79,4.74 ; 25.8,7.85 25.8,8.94 25.79,8.95 ; v1(30.73,3.82) 30.73,5.05 30.73,5.06
  vias: v1(23.66,10.66) v1(25.8,7.9) v1(25.77,3.52)
USART6_RX: length 40.8
  Top Layer w0.28: v1(52.4,15.11) 53.52,16.23 U78.38
  Top Layer w0.4: 87.04,7.9 87.02,7.92 v1(85.07,7.92)
  Inner2 w0.4: v1(85.07,7.92) 85.07,9.09 80.28,13.88 63.83,13.88 62.77,12.82 58.1,12.82 55.81,15.11 v1(52.4,15.11)
USART6_TX: length 48.3
  Top Layer w0.28: v1(54.64,18.03) 54.09,17.48 54.09,17.47 U78.37
  Top Layer w0.4: v1(85.05,4.1) 85.06,4.09 U8.4
  Inner2 w0.4: v1(54.64,18.03) 57.56,18.03 58.74,16.85 58.74,14.87 59.16,14.45 61.88,14.45 63.01,15.58 81.16,15.58 86.88,9.86 86.88,5.35 85.63,4.1 v1(85.05,4.1)
USB_DM: length 29.7
  Top Layer w0.28: v1(53.71,13.15) 54.72,13.15 55.67,14.11
  Top Layer w0.5: v1(34.38,22.84) 34.38,21.75
  Top Layer w0.6: v1(34.38,22.84) 34.38,24.57 34.98,25.17 40.28,25.17 52.3,13.15 v1(53.71,13.15)
USB_DP: length 26.1
  Top Layer w0.28: U78.45 54.63,12.36 v1(54.38,12.36)
  Top Layer w0.6: v1(54.38,12.36) 51.73,12.36 41.24,22.85 v1(35.94,22.85) 35.94,21.76 R46.2
VBOOT_1: length 31.8
  Top Layer w0.5: v1(12.6,55.21) 14.6,55.21 14.61,55.2
  Top Layer w0.6: C48.1 36.31,50.08 D8.1 26.19,50.08 v1(25.8,50.47)
  Inner1 w0.5: v1(12.6,55.21) 12.28,55.21 11.78,54.71 11.78,51.77 13.18,50.37 25.7,50.37 v1(25.8,50.47)
VBOOT_2: length 32.7
  Top Layer w0.5: 94.5,59.31 94.51,59.29 v1(96.51,59.29)
  Top Layer w0.6: v1(77.86,63.08) 76.1,61.33 D10.1 75.13,61.11 73.26,61.11
  Inner1 w0.5: v1(96.51,59.29) 96.99,59.29 97.49,59.79 97.49,63.63 96.99,64.13 78.91,64.13 v1(77.86,63.08)
VCAP_1: length 2.3
  Top Layer w0.28: 51.16,23.26 51.16,22.86 52.49,21.53
VCP_1: length 16.7
  Top Layer w0.4: 41.23,51.24 v1(41.23,50.02)
  Top Layer w0.5: 27.91,55.2 v1(29.98,55.2)
  Inner2 w0.4: v1(41.23,50.02) 35.15,50.02 v1(29.98,55.2)
VCP_2: length 14.8
  Top Layer w0.4: C57.1 v1(68.75,61.48)
  Top Layer w0.5: 81.2,59.31 v1(79.13,59.31)
  Inner2 w0.4: v1(68.75,61.48) 72.4,61.48 74.9,58.98 78.81,58.98 v1(79.13,59.31)
$1N14481: length 2.1
  Top Layer w0.6: U6.2 66.71,44.19 R1.2
$1N50612: length 6
  Top Layer w0.4: U9.12 93.56,21.45 93.3,21.71 93.3,22.41 93.6,22.72 U9.13 R34.1
$1N52994: length 2.2
  Top Layer w0.4: 41.23,52.64 40.98,52.64 39.58,51.24
$1N52996: length 5.8
  Top Layer w0.6: D8.2 37.01,53.55 D7.1 38.21,54.11 R37.1
$1N54500: length 2.2
  Top Layer w0.4: R40.2 69,58.86 C57.2
$1N54502: length 5.7
  Top Layer w0.4: R40.1 70.98,58.75 D9.1
  Top Layer w0.6: D10.2 74.03,57.86 73.62,57.45 D9.1
$1N66553: length 38.9
  Top Layer w2.5: CN1.2 65.48,64.62 U84.1
  Inner1 w2.5: 59.81,58.99 v1(61.54,60.71) v1(62.91,62.08) v1(64.37,63.55) 65.46,64.63 70.44,64.63
  Inner2 w2.5: 59.84,58.99 65.47,64.63 70.47,64.63
  vias: v1(61.5,59.61) v1(61.61,61.86) v1(62.94,61.02) v1(63.01,63.44) v1(64.35,64.62) v1(64.39,62.4) v1(65.74,64.62) v1(65.73,63.65) v1(65.76,65.51) v1(66.87,65.48) v1(66.86,63.75)
$1N88741: length 2.6
  Top Layer w0.4: 77.09,49.86 77.09,49.2 76.91,49.02 76.91,47.44 76.94,47.4
$1N90501: length 2.9
  Top Layer w0.4: 41.39,47.92 41.24,47.77 U10.10
$1N102361: length 7.6
  Top Layer w0.4: 94.98,4.51 94.15,5.35 92.08,5.35 ; R16.1 95.67,5.42 R13.2 95.39,4.32 R14.2
$1N102367: length 7.4
  Top Layer w0.4: R13.1 95.37,8.08 R12.2 ; 93.92,6.62 94.98,7.69 95.77,6.9 R15.1 ; 92.29,6.61 93.92,6.61
$1N106732: length 16.7
  Top Layer w0.3: 11.65,30.18 4.43,30.18 1.18,33.43 1.18,35.23 Left_ADC.4
$1N106734: length 10.5
  Top Layer w0.3: Left_ADC.6 4.52,38.75 6.98,38.75 11.11,34.62 11.65,34.62
$1N106736: length 22.9
  Top Layer w0.3: Left_ADC.8 4.66,41.15 6.53,41.15 11.22,36.46 19.93,36.46 21.87,34.52 22.9,34.52 22.95,34.56
$1N110429: length 15.8
  Top Layer w0.3: 17.2,40.31 16.13,40.31 15.16,41.28 9.8,41.28 7.35,43.73 4.62,43.73 Left_ADC.10
$1N122577: length 18.1
  Top Layer w0.3: 91.34,40.28 92.47,40.28 93.32,41.13 97.93,41.13 102.99,46.19 105.24,46.19 Right_ADC.4
$1N122580: length 25.7
  Top Layer w0.3: Right_ADC.6 105.2,43.61 103.12,43.61 99.13,39.62 99.13,37.94 97.57,36.38 87.68,36.38 86.71,35.41 85.75,35.41
$1N122586: length 14
  Top Layer w0.3: 96.95,35.06 96.97,35.08 98.42,35.08 100.09,36.75 100.09,39.22 101.94,41.07 105.2,41.07 Right_ADC.8
$1N122589: length 21.3
  Top Layer w0.3: 85.66,40.27 86.59,40.27 87.93,41.61 97.59,41.61 103.44,47.46 Right_ADC.3
$1N122592: length 8.9
  Top Layer w0.3: Right_ADC.5 103.33,44.92 98.73,40.32 96.97,40.32 96.95,40.34
